# Altium schematic sheet CE842170047_SHEET1.SchDoc
size Tabloid; SheetNumber: 1; SheetTotal: 5; PageSetup: Record=PageOptions|CenterHorizontal=True|CenterVertical=True|PrintScale=0.70|XCorrection=1.00|YCorrection=1.00|PrintKind=1|BorderSize=5000000|LeftOffset=0|BottomOffset=0|Orientation=2|PaperLength=1000|PaperWidth=1000|Scale=100|PaperSource=7|PrintQuality=-4|MediaType=1|DitherType=10|PaperKind=8 1/2x11|PrintScaleMode=1; SPICEModelCacheMIYJXAQF: <root> / <DocumentId>MIYJXAQF</DocumentId> / </root>
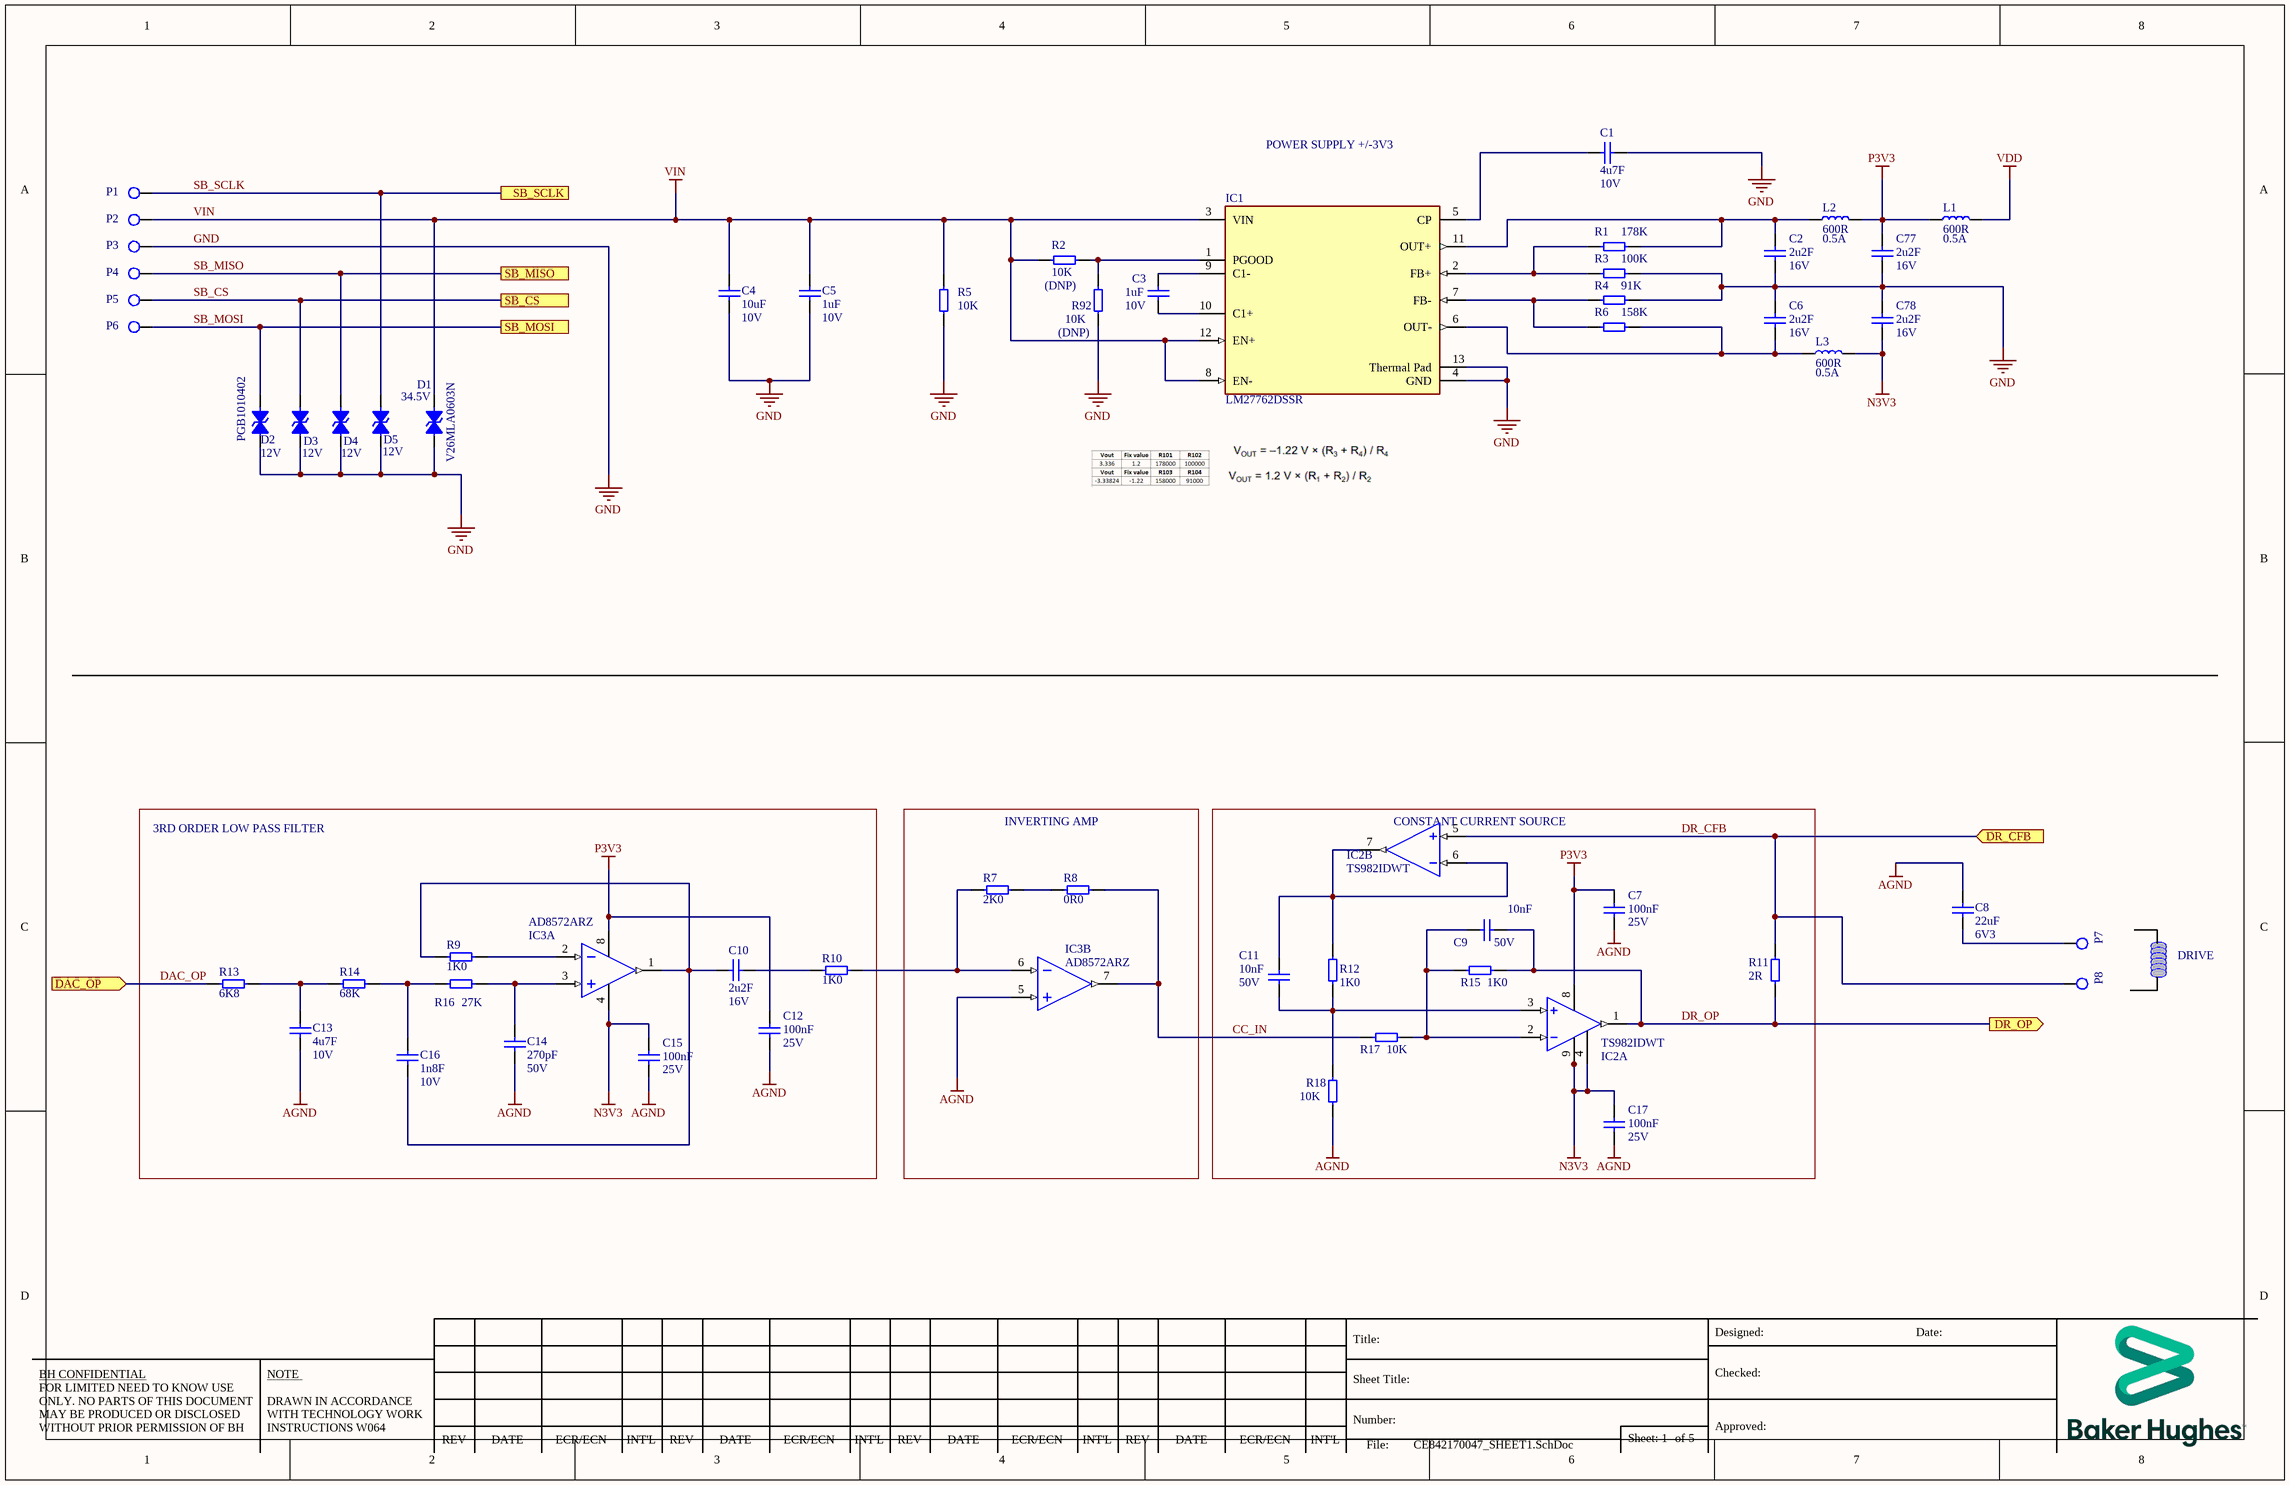
[diagram p0: CE842170047_SHEET1.SchDoc]

## Parts
C1  value 4u7F  Voltage: 10V  [C0603]  (hidden comment: KK/96159/2666)
C2  value 2u2F  Voltage: 16V  [C0603]  (hidden comment: KK/96159/3634)
C3  value 1uF  Voltage: 10V  [C0603]  (hidden comment: KK/96159/2601)
C4  value 10uF  Voltage: 10V  [C0603]  (hidden comment: KK/96159/3701)
C5  value 1uF  Voltage: 10V  [C0603]  (hidden comment: KK/96159/2601)
C6  value 2u2F  Voltage: 16V  [C0603]  (hidden comment: KK/96159/3634)
C7  value 100nF  Voltage: 25V  [C0603]  (hidden comment: KK/96159/4501)
C8  value 22uF  Voltage: 6V3  [C0805]  (hidden comment: KK/96160/0734)
C9  value 10nF  Voltage: 50V  [C0603]  (hidden comment: KK/96159/0401)
C10  value 2u2F  Voltage: 16V  [C0603]  (hidden comment: KK/96159/3634)
C11  value 10nF  Voltage: 50V  [C0603]  (hidden comment: KK/96159/0401)
C12  value 100nF  Voltage: 25V  [C0603]  (hidden comment: KK/96159/4501)
C13  value 4u7F  Voltage: 10V  [C0603]  (hidden comment: KK/96159/2666)
C14  value 270pF  Voltage: 50V  [C0603]  (hidden comment: KK/96159/0243)
C15  value 100nF  Voltage: 25V  [C0603]  (hidden comment: KK/96159/4501)
C16  value 1n8F  Voltage: 10V  [C0603]  (hidden comment: KK/96159/0325)
C17  value 100nF  Voltage: 25V  [C0603]  (hidden comment: KK/96159/4501)
C77  value 2u2F  Voltage: 16V  [C0603]  (hidden comment: KK/96159/3634)
C78  value 2u2F  Voltage: 16V  [C0603]  (hidden comment: KK/96159/3634)
D1  value 34.5V  MF_PartNumber: V26MLA0603N  [R0603]  (hidden comment: KK/95070/0035)
D2  MF_PartNumber: PGB1010402  Voltage: 12V  [ESD0402]  (hidden comment: KK/95070/0036)
D3  Voltage: 12V  [ESD0402]  (hidden comment: KK/95070/0036)
D4  Voltage: 12V  [ESD0402]  (hidden comment: KK/95070/0036)
D5  Voltage: 12V  [ESD0402]  (hidden comment: KK/95070/0036)
IC1  MF_PartNumber: LM27762DSSR  [WSON-12]  (hidden comment: KK/95311/0117)
IC2  MF_PartNumber: TS982IDWT  [SOIC-8_EP]  (hidden comment: KK/95312/0246)  (parts A,B of 2)
IC3  MF_PartNumber: AD8572ARZ  [SOIC-8]  (hidden comment: KK/95312/0244)  (parts A,B of 2)
L1  value 600R  Power: 0.5A  [L0603]  (hidden comment: KK/97900/1033)
L2  value 600R  Power: 0.5A  [L0603]  (hidden comment: KK/97900/1033)
L3  value 600R  Power: 0.5A  [L0603]  (hidden comment: KK/97900/1033)
P1  TESTPAD1  [P0.8xH0.5]  (value not drawn)
P2  TESTPAD1  [P0.8xH0.5]  (value not drawn)
P3  TESTPAD1  [P0.8xH0.5]  (value not drawn)
P4  TESTPAD1  [P0.8xH0.5]  (value not drawn)
P5  TESTPAD1  [P0.8xH0.5]  (value not drawn)
P6  TESTPAD1  [P0.8xH0.5]  (value not drawn)
P7  TESTPAD1  [P0.8xH0.5]  (value not drawn)
P8  TESTPAD1  [P0.8xH0.5]  (value not drawn)
R1  value 178K  [R0603]  (hidden comment: KK/96059/0725)
R2  value 10K  [R0603]  (hidden comment: KK/96059/0601)
R3  value 100K  [R0603]  (hidden comment: KK/96059/0701)
R4  value 91K  [R0603]  (hidden comment: KK/96059/1693)
R5  value 10K  [R0603]  (hidden comment: KK/96059/0601)
R6  value 158K  [R0603]  (hidden comment: KK/96059/0720)
R7  value 2K0  [R0603]  (hidden comment: KK/96059/0530)
R8  value 0R0  [R0603]  (hidden comment: KK/96059/0000)
R9  value 1K0  [R0603]  (hidden comment: KK/96059/0501)
R10  value 1K0  [R0603]  (hidden comment: KK/96059/0501)
R11  value 2R  [R2512]  (hidden comment: KK/96090/0230)
R12  value 1K0  [R0603]  (hidden comment: KK/96059/0501)
R13  value 6K8  [R0603]  (hidden comment: KK/96059/0581)
R14  value 68K  [R0603]  (hidden comment: KK/96059/0681)
R15  value 1K0  [R0603]  (hidden comment: KK/96059/0501)
R16  value 27K  [R0603]  (hidden comment: KK/96059/0643)
R17  value 10K  [R0603]  (hidden comment: KK/96059/0601)
R18  value 10K  [R0603]  (hidden comment: KK/96059/0601)
R92  value 10K  [R0603]  (hidden comment: KK/96059/0601)

## Blocks framed on the sheet
3RD ORDER LOW PASS FILTER: C10 C12-C16 IC3 R9 R10 R13 R14 R16
INVERTING AMP: IC3 R7 R8
CONSTANT CURRENT SOURCE: C7 C9 C11 C17 IC2 R11 R12 R15 R17 R18

## Ports
DAC_OP (in), DR_CFB (in), DR_OP (out), SB_CS, SB_MISO, SB_MOSI, SB_SCLK

## Nets
AGND: C7.2 C8.1 C12.2 C13.2 C14.2 C15.2 C17.2 IC3.5(+IN_B) R18.1
GND: C1.2 C2.2 C4.2 C5.2 C6.1 C77.2 C78.1 D1.1 D2.1 D3.1 D4.1 D5.1 IC1.4(GND) IC1.13(Thermal_Pad) P3.1 R3.2 R4.2 R5.2 R92.1
N3V3: C15.1 C17.1 C78.2 IC2.4(VCC-) IC2.9(VCC-) IC3.4(-V) L3.2
P3V3: C7.1 C12.1 C77.1 IC2.8(VCC+) IC3.8(+V) L1.1 L2.2
VDD: L1.2
VIN: C4.1 C5.1 D1.2 IC1.3(VIN) IC1.8(EN-) IC1.12(EN+) P2.1 R2.1 R5.1
CC_IN: IC3.7(OUT_B) R8.2 R17.2
DAC_OP: R13.1 ; port DAC_OP
DR_CFB: IC2.5(NON_INVERTING_INPUT_2) P8.1 R11.2 ; port DR_CFB
DR_OP: C9.2 IC2.1(OUTPUT1) R11.1 R15.1 ; port DR_OP
SB_CS: D3.2 P5.1 ; port SB_CS
SB_MISO: D4.2 P4.1 ; port SB_MISO
SB_MOSI: D2.2 P6.1 ; port SB_MOSI
SB_SCLK: D5.2 P1.1 ; port SB_SCLK
NetC1_1: C1.1 IC1.5(CP)
NetC2_1: C2.1 IC1.11(OUT+) L2.1 R1.2
NetC3_1: C3.1 IC1.9(C1-)
NetC3_2: C3.2 IC1.10(C1+)
NetC6_2: C6.2 IC1.6(OUT-) L3.1 R6.2
NetC8_2: C8.2 P7.1
NetC9_1: C9.1 IC2.2(INVERTING_INPUT_1) R15.2 R17.1
NetC10_1: C10.1 C16.2 IC3.1(OUT_A) R9.1
NetC10_2: C10.2 R10.1
NetC11_1: C11.1 IC2.6(INVERTING_INPUT_2) IC2.7(OUTPUT2) R12.2
NetC11_2: C11.2 IC2.3(NON_INVERTING_INPUT_1) R12.1 R18.2
NetC13_1: C13.1 R13.2 R14.1
NetC14_1: C14.1 IC3.3(+IN_A) R16.2
NetC16_1: C16.1 R14.2 R16.1
NetIC1_1: IC1.1(PGOOD) R2.2 R92.2
NetIC1_2: IC1.2(FB+) R1.1 R3.1
NetIC1_7: IC1.7(FB-) R4.1 R6.1
NetIC3_2: IC3.2(-IN_A) R9.2
NetIC3_6: IC3.6(-IN_B) R7.1 R10.2
NetR7_2: R7.2 R8.1

## Notes on the sheet
- POWER SUPPLY +/-3V3
- (DNP)
- (near R92) (DNP)
- DRIVE
- BH CONFIDENTIAL
- NOTE
- Title:
- Sheet Title:
- Designed:
- Checked:
- Date:
- DRAWN IN ACCORDANCE WITH TECHNOLOGY WORK INSTRUCTIONS W064
- REV
- DATE
- ECR/ECN
- INT'L
- Number:
- Approved:
- FOR LIMITED NEED TO KNOW USE ONLY. NO PARTS OF THIS DOCUMENT MAY BE PRODUCED OR DISCLOSED WITHOUT PRIOR PERMISSION OF BH
- File:
- Sheet:
- of

## Library data of the parts
C1 C13 = KK/96159/2666: CAPACITOR_4u7F_10%_10V_0603; ID: 165; Tolerance: 10%; PII_PartNumber: KK/96159/2666; Pins: 2
C2 C6 C10 C77 C78 = KK/96159/3634: CAPACITOR CERAMIC 0603 16V 10% X5R 2u2; ID: 569; PII_PartNumber: KK/96159/3634; Pins: 2; Tolerance: 10%
C3 C5 = KK/96159/2601: CAPACITOR_1uF_+10%_10V_603; ID: 164; Tolerance: 10%; PII_PartNumber: KK/96159/2601; Pins: 2
C4 = KK/96159/3701: CAPACITOR_10uF_10%_10V_0603; ID: 175; Tolerance: 10%; PII_PartNumber: KK/96159/3701; Pins: 2
C7 C12 C15 C17 = KK/96159/4501: CAPACITOR_100nF_+10%_25V_603; ID: 185; Tolerance: 10%; PII_PartNumber: KK/96159/4501; Pins: 2
C8 = KK/96160/0734: CAPACITOR_22uF_20%_6V3_0805; ID: 246; Tolerance: 20%; PII_PartNumber: KK/96160/0734; Pins: 2; Temperature: -55 +125C
C9 C11 = KK/96159/0401: CAPACITOR CERAMIC 0603 50V 10% X7R 10nF; ID: 571; PII_PartNumber: KK/96159/0401; Pins: 2; Tolerance: 10%
C14 = KK/96159/0243: CAPACITOR CER 0603 270pF 10% 50V X5R; ID: 577; PII_PartNumber: KK/96159/0243; Pins: 2; Tolerance: 10%
C16 = KK/96159/0325: CAPACITOR CER 0603 1n8F 10% 10V X5R; ID: 576; PII_PartNumber: KK/96159/0325; Pins: 2; Tolerance: 10%
D1 = KK/95070/0035: TVS,SMD,LITTLEFUSE,V26MLA0603N[20-26V]; ID: 261; Voltage: 26V; PII_PartNumber: KK/95070/0035; Pins: 2; Manufacturer: LITTLEFUSE; Temperature: -55°C +125°C
D2-D5 = KK/95070/0036: SUPPRESSOR ESD,SMD,0402,12VDC,LIF,PGB1010402; Manufacturer: LITTELFUSE; ID: 262; PII_PartNumber: KK/95070/0036; Pins: 2
  D3-D5: MF_PartNumber: PGB1010402
IC1 = KK/95311/0117: SWITCHING REGULATOR; Manufacturer: TEXAS INSTRUMENTS; Topology: Charge Pump; Min Output Voltage: 1.5V; Max Input Voltage: 5.5V; Synchronous Rectifier: No; Output Type: Adjustable; Output Current: 250mA; Min Input Voltage: 2.7V; Quiescent Current: 390uA; Switching Frequency: 2.3MHz; Max Output Voltage: 5V; ID: 104; Voltage: 2.7-5.5V; Lead Free: Lead Free; Min Operating Temperature: -40°C; Max Operating Temperature: 85°C; RoHS Compliant: Yes; Packaging: Tape and Reel; Mount: Surface Mount; Manufacturer Part Number: LM27762DSSR; PII_PartNumber: KK/95311/0117; Pins: 12; Power: 250mA; Temperature: -40 to +85C
IC2 = KK/95312/0246: DUAL BIPOLAR OPERATIONAL AMPLIFIER; Manufacturer: STMICROELECTRONICS; Value: 400mA; ID: 108; Voltage: 5.5V; Package: None; Price: None; MP: TS982IDWT; Availability: Unavailable; PII_PartNumber: KK/95312/0246; Pins: 8; Temperature: -40 to +125C
IC3 = KK/95312/0244: DUAL RAIL to RAIL OP AMP; Manufacturer: Analog Devices; Amplifiers Per Package: 2; Iq/Amp: 975uA; Input Offset Voltage: 1uV; Slew Rate: 400mV/us; Small Signal Bandwidth: 1.5MHz; Input Bias Current: 10pA; V Span Min: 2.7V; V Span Max: 6V; ID: 106; Value: 1.5MHz; Voltage: 5V; PackageVersion: 060506-A; ComponentLink1Description: Manufacturer URL; Code_JEDEC: MS-012-AA; PackageReference: R-8; ComponentLink1URL: http://www.analog.com/en/index.html; Mounting Technology: Surface Mount; ComponentLink2Description: Datasheet; ComponentLink3Description: Package Specification; DatasheetVersion: Rev. E; ComponentLink2URL: http://www.analog.com/static/imported-files/data_sheets/AD8571_8572_8574.pdf; Generic Part Number: AD8572; PartNumber: AD8572ARZ; PackageDescription: 8-Pin Standard Small Outline Package, Body 3.9 x 4.9 mm, Pitch 1.27 mm; ComponentLink3URL: http://www.analog.com/static/imported-files/packages/PKG_PDF/SOIC_Narrow%20(R)/R_8.pdf; Manufacturer Part Number: AD8572ARZ; PII_PartNumber: KK/95312/0244; Pins: 8; Temperature: -40 to +125C
L1-L3 = KK/97900/1033: FERRIT BEADS 0603 600R 0.5A 25%; MF_PartNumber: 742863160; Manufacturer: WUERTH; ID: 158; PII_PartNumber: KK/97900/1033; Pins: 2; Tolerance: 25%; Temperature: -55 to +125C
P1-P8 = TESTPAD1: P0.8 X H0.5 X 0.9SM; Manufacturer: PCB MANUFACTURER; ID: 26; PII_PartNumber: TESTPAD1; MF_PartNumber: P0.8 X H0.5 X 0.9SM; Pins: 1
R1 = KK/96059/0725: RESISTOR 0603 0.063W 0.1% 178K; ID: 1402; PII_PartNumber: KK/96059/0725; Pins: 2; Tolerance: 0.1%; Power: 0.063W
R2 R5 R17 R18 R92 = KK/96059/0601: RESISTOR_10K_1%_0603J_63mW; ID: 1090; Tolerance: 1%; Power: 63mW; PII_PartNumber: KK/96059/0601; Pins: 2
R3 = KK/96059/0701: RESISTOR_100K_1%_0603J_63mW; ID: 1111; Tolerance: 1%; Power: 63mW; PII_PartNumber: KK/96059/0701; Pins: 2
R4 = KK/96059/1693: RESISTOR 0603 0.063W 1% 91K; ID: 1396; PII_PartNumber: KK/96059/1693; Pins: 2; Tolerance: 1%; Power: 0.063W
R6 = KK/96059/0720: RESISTOR_158K_1%_0603J_63mW; ID: 1118; Tolerance: 1%; Power: 63mW; PII_PartNumber: KK/96059/0720; Pins: 2
R7 = KK/96059/0530: RESISTOR_2K_1%_0603J_63m2; ID: 1077; Tolerance: 1%; Power: 63mW; PII_PartNumber: KK/96059/0530; Pins: 2
R8 = KK/96059/0000: ZERO OHM LINK; ID: 7; Power: 63mW; PII_PartNumber: KK/96059/0000; Pins: 2
R9 R10 R12 R15 = KK/96059/0501: RESISTOR_1K0_1%_0603J_63mW; ID: 1072; Tolerance: 1%; Power: 0.1W; PII_PartNumber: KK/96059/0501; Pins: 2
R11 = KK/96090/0230: RESISTOR 2R 2512 1% 1W; ID: 1382; PII_PartNumber: KK/96090/0230; Pins: 2; Tolerance: 1%; Power: 1W
R13 = KK/96059/0581: RESISTOR 0603 0.063W 1% 6K8; ID: 1403; PII_PartNumber: KK/96059/0581; Pins: 2; Tolerance: 1%; Power: 0.063W
R14 = KK/96059/0681: RESISTOR_68K_1%_0603J_63mW; ID: 1107; Tolerance: 1%; Power: 63mW; PII_PartNumber: KK/96059/0681; Pins: 2
R16 = KK/96059/0643: RESISTOR 0603 0.063W 1% 27K; ID: 1404; PII_PartNumber: KK/96059/0643; Pins: 2; Tolerance: 1%; Power: 0.063W